# EAGLE design kolektorius_v21 (EAGLE 6.3)
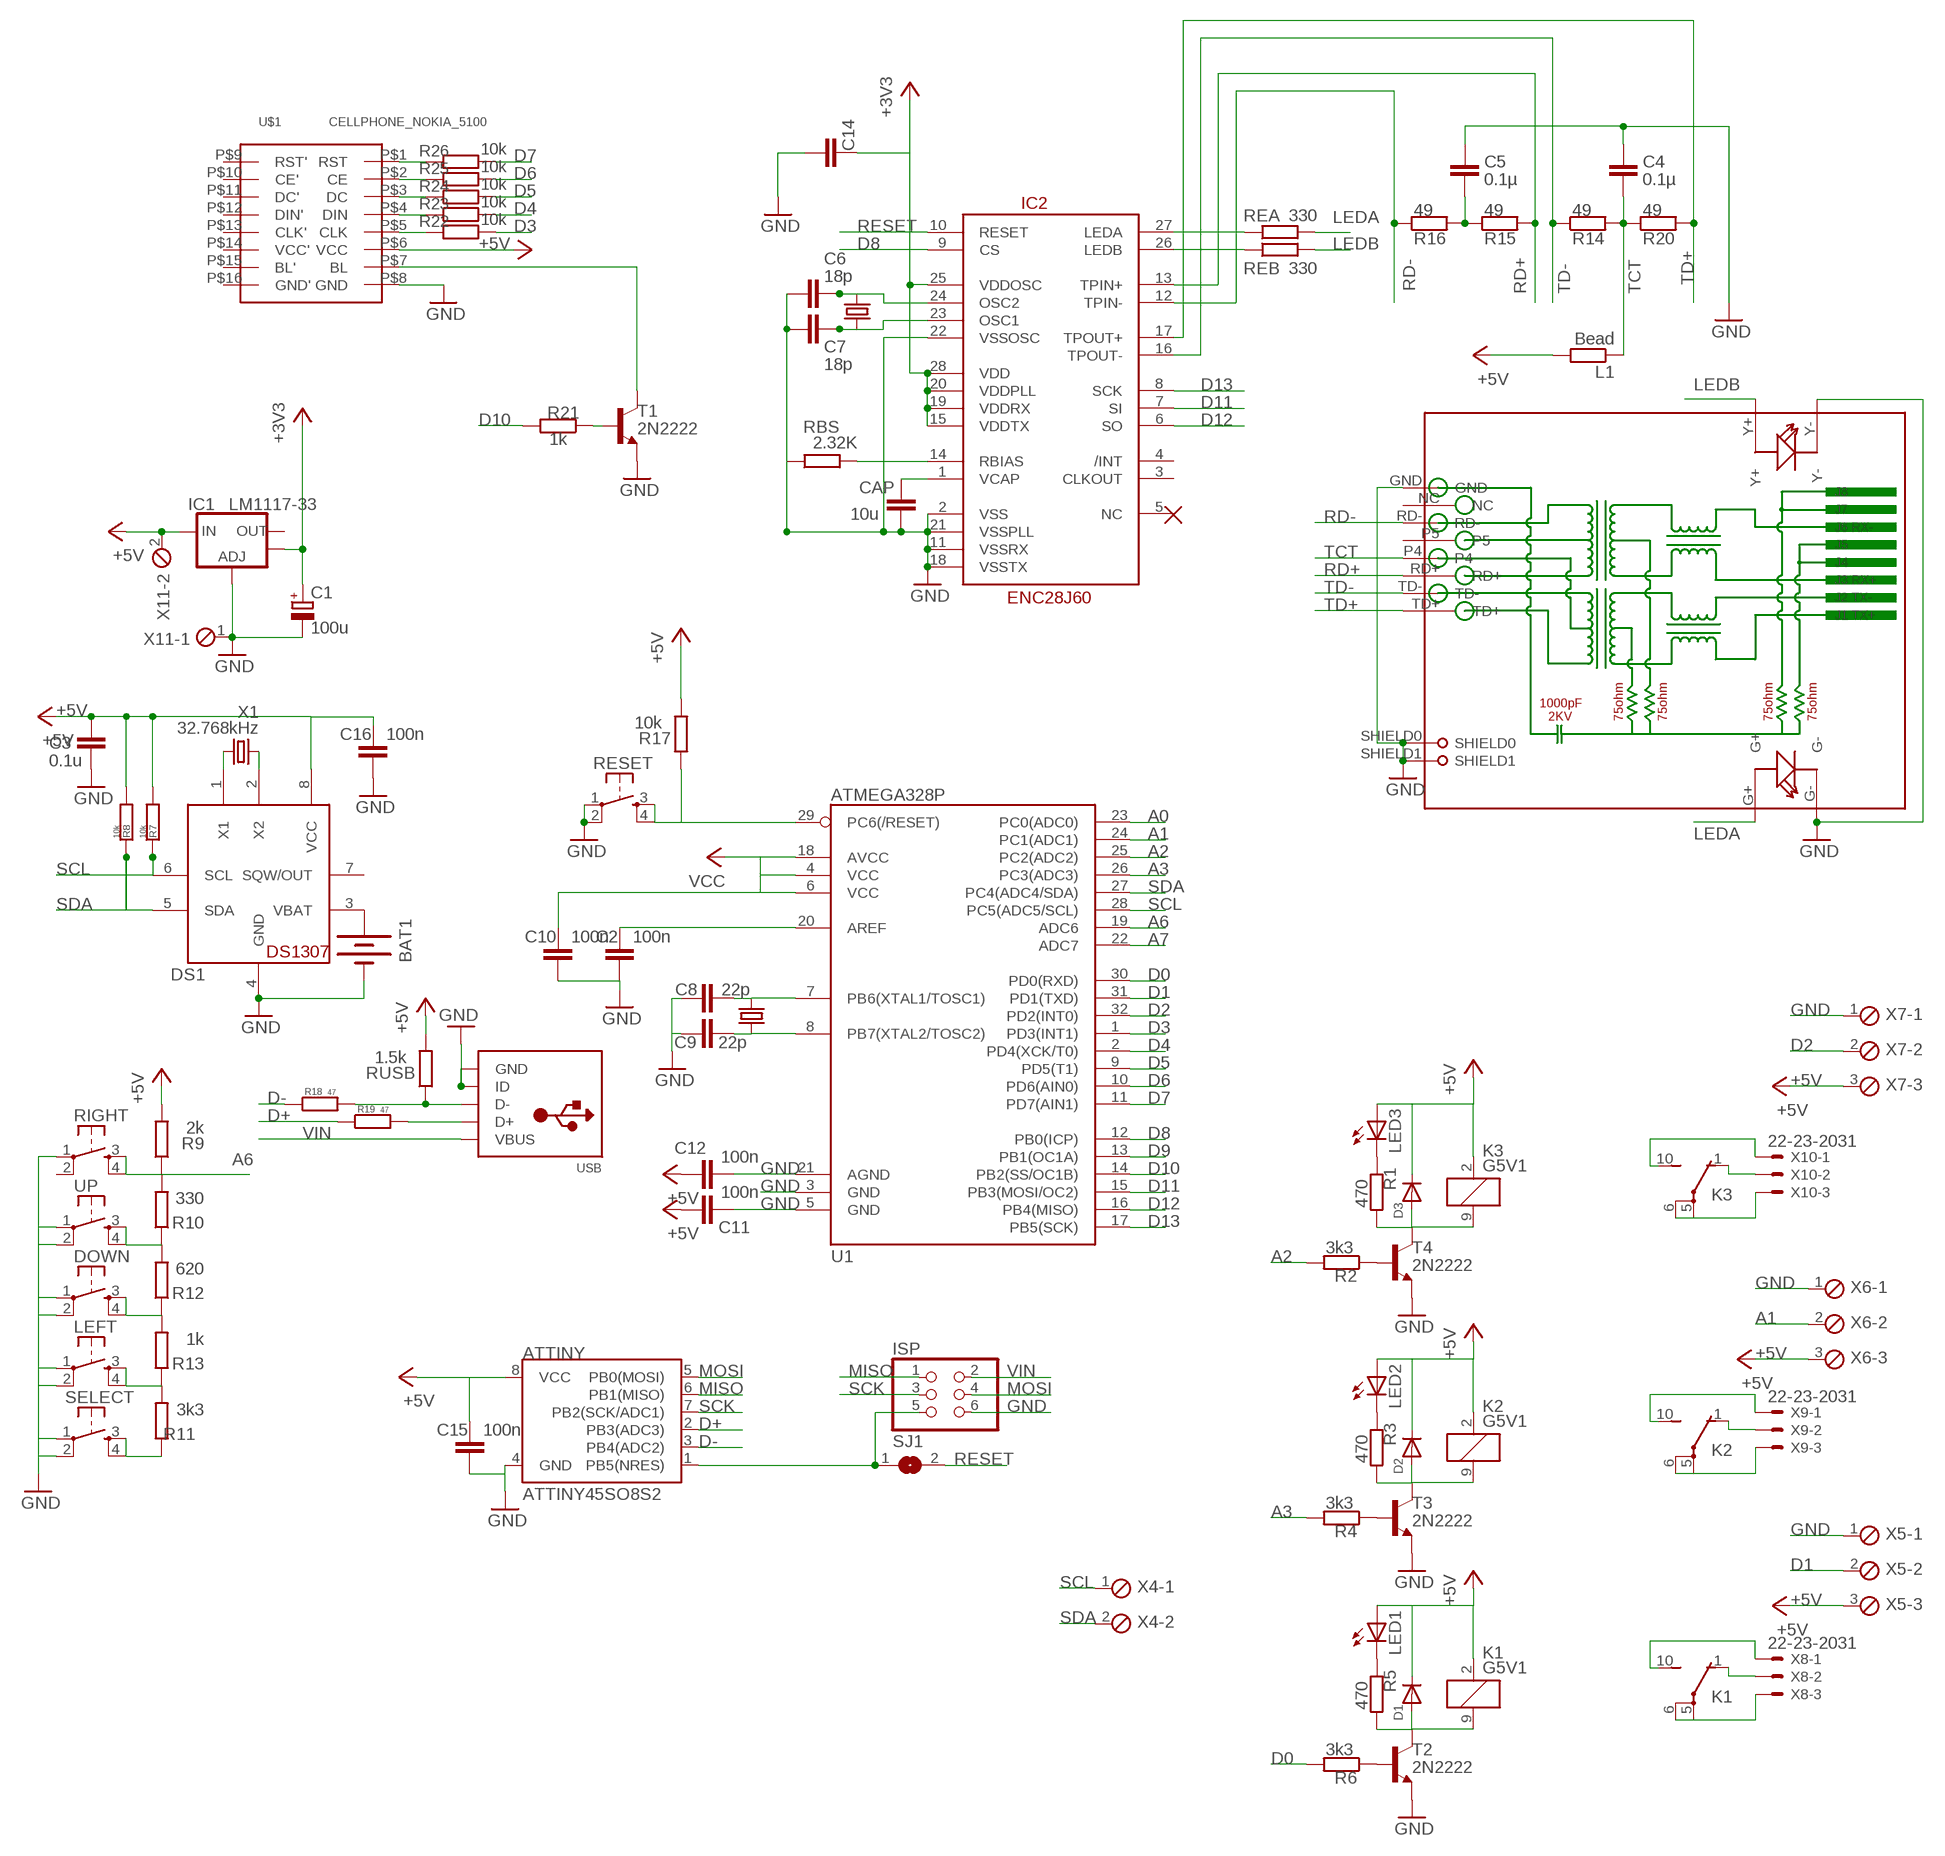
[diagram p0: schematic, sheet 1]

## Parts
ATTINY  ATTINY45SO8S2  [SO8S2]
BAT1  BATTERYBATTERY_12MM_SMT  [BATTCON_12MM_SMT]
C1  100u  CPOL-EUE2-5  [E2-5]
C2  100n  C-EUC0805  [C0805]
C3  0.1u  C-EUC0805  [C0805]
C4  0.1µ  C-EUC0805  [C0805]
C5  0.1µ  C-EUC0805  [C0805]
C6  18p  C-EUC0805  [C0805]
C7  18p  C-EUC0805  [C0805]
C8  22p  C-EUC0805  [C0805]
C9  22p  C-EUC0805  [C0805]
C10  100n  C-EUC0805  [C0805]
C11  100n  C-EUC0805  [C0805]
C12  100n  C-EUC0805  [C0805]
C14  100n  C-EUC0805  [C0805]
C15  100n  C-EUC0805  [C0805]
C16  100n  C-EUC0805  [C0805]
CAP  10u  C-EUC0805  [C0805]
D1  DIODEDO-1N4148  [DO-1N4148]
D2  DIODEDO-1N4148  [DO-1N4148]
D3  DIODEDO-1N4148  [DO-1N4148]
DOWN  TAC_SWITCHPTH  [TACTILE-PTH]
DS1  DS1307  DS1307SOIC  [SO08]
IC1  LM1117-33  V_REG_LM1117SOT223  [SOT223]
IC2  ENC28J60  [SSOP28DB]
ISP  PINHD-2X3  [2X03]
K1  G5V1  [G5V1]
K2  G5V1  [G5V1]
K3  G5V1  [G5V1]
L1  Bead  R-EU_R0805  [R0805]
LED1  LEDSMT1206  [1206]
LED2  LEDSMT1206  [1206]
LED3  LEDSMT1206  [1206]
LEFT  TAC_SWITCHPTH  [TACTILE-PTH]
R1  470  R-EU_R0805  [R0805]
R2  3k3  R-EU_R0805  [R0805]
R3  470  R-EU_R0805  [R0805]
R4  3k3  R-EU_R0805  [R0805]
R5  470  R-EU_R0805  [R0805]
R6  3k3  R-EU_R0805  [R0805]
R7  10k  R-EU_R0805  [R0805]
R8  10k  R-EU_R0805  [R0805]
R9  2k  R-EU_R0805  [R0805]
R10  330  R-EU_R0805  [R0805]
R11  3k3  R-EU_R0805  [R0805]
R12  620  R-EU_R0805  [R0805]
R13  1k  R-EU_R0805  [R0805]
R14  49  R-EU_R0805  [R0805]
R15  49  R-EU_R0805  [R0805]
R16  49  R-EU_R0805  [R0805]
R17  10k  R-EU_R0805  [R0805]
R18  47  R-EU_R0805  [R0805]
R19  47  R-EU_R0805  [R0805]
R20  49  R-EU_R0805  [R0805]
R21  1k  R-EU_R0805  [R0805]
R22  10k  R-EU_R0805  [R0805]
R23  10k  R-EU_R0805  [R0805]
R24  10k  R-EU_R0805  [R0805]
R25  10k  R-EU_R0805  [R0805]
R26  10k  R-EU_R0805  [R0805]
RBS  2.32K  R-EU_R0805  [R0805]
REA  330  R-EU_R0805  [R0805]
REB  330  R-EU_R0805  [R0805]
RESET  TAC_SWITCHPTH  [TACTILE-PTH]
RIGHT  TAC_SWITCHPTH  [TACTILE-PTH]
RJ1  HR911105A  [HR911105A]
RUSB  1.5k  R-EU_R0805  [R0805]
SELECT  TAC_SWITCHPTH  [TACTILE-PTH]
SJ1  SJ  [SJ]
T1  2N2222  [TO92-EBC-OVAL]
T2  2N2222  [TO92-EBC-OVAL]
T3  2N2222  [TO92-EBC-OVAL]
T4  2N2222  [TO92-EBC-OVAL]
U1  ATMEGA328P  ATMEGA328_SMT  [TQFP32-08]
U$1  CELLPHONE_NOKIA_5100  [CELLPHONE_NOKIA_5100_SPARKFUN]
UP  TAC_SWITCHPTH  [TACTILE-PTH]
USB  USBMOLEX  [USB-MINIB-THM-MOLEX]
X1  32.768kHz  CRYSTALTC26H  [TC26H]
X2  16MHz  CRYSTALHC49US  [HC49US]
X3  25MHz  CRYSTALHC49US  [HC49US]
X4  MPT2  [2POL254]
X5  MPT3  [3POL254]
X6  MPT3  [3POL254]
X7  MPT3  [3POL254]
X8  22-23-2031  [22-23-2031]
X9  22-23-2031  [22-23-2031]
X10  22-23-2031  [22-23-2031]
X11  MPT2  [2POL254]

## Nets
+3V3: C1.+ C14.1 IC1.4(OUT) IC2.15(VDDTX) IC2.19(VDDRX) IC2.20(VDDPLL) IC2.25(VDDOSC) IC2.28(VDD)
+5V: ATTINY.8(VCC) C3.1 C11.2 C12.2 C15.1 C16.1 D1.C D2.C D3.C DS1.8(VCC) IC1.3(IN) K1.2 K2.2 K3.2 L1.2 LED1.A LED2.A R7.2 R8.2 U$1.P$6(VCC) X5.3 X6.3 X7.3 X11.2
A0: U1.23(PC0(ADC0))
A1: U1.24(PC1(ADC1)) X6.2
A2: R2.2 U1.25(PC2(ADC2))
A3: R4.2 U1.26(PC3(ADC3))
A6: R9.1 R10.2 RIGHT.3 RIGHT.4 U1.19(ADC6)
A7: U1.22(ADC7)
D0: R6.2 U1.30(PD0(RXD))
D1: U1.31(PD1(TXD)) X5.2
D2: U1.32(PD2(INT0)) X7.2
D3: R22.2 U1.1(PD3(INT1))
D4: R23.2 U1.2(PD4(XCK/T0))
D5: R24.2 U1.9(PD5(T1))
D6: R25.2 U1.10(PD6(AIN0))
D7: R26.2 U1.11(PD7(AIN1))
D8: IC2.9(CS) U1.12(PB0(ICP))
D9: U1.13(PB1(OC1A))
D10: R21.2 U1.14(PB2(SS/OC1B))
D11: IC2.7(SI) U1.15(PB3(MOSI/OC2))
D12: IC2.6(SO) U1.16(PB4(MISO))
D13: IC2.8(SCK) U1.17(PB5(SCK))
D+: ATTINY.2(PB3(ADC3)) R19.1
D-: ATTINY.3(PB4(ADC2)) R18.1
GND: ATTINY.4(GND) BAT1.P$1(-) C1.- C2.2 C3.2 C4.1 C5.1 C6.2 C7.2 C8.1 C9.1 C10.2 C11.1 C12.1 C14.2 C15.2 C16.2 CAP.2 DOWN.1 DOWN.2 DS1.4(GND) IC1.1(ADJ) IC2.2(VSS) IC2.11(VSSRX) IC2.18(VSSTX) IC2.21(VSSPLL) IC2.22(VSSOSC) ISP.6 LEFT.1 LEFT.2 RBS.1 RESET.1 RESET.2 RIGHT.1 RJ1.G- RJ1.GND RJ1.SHIELD0 RJ1.SHIELD1 RJ1.Y- SELECT.1 SELECT.2 T1.E T2.E T3.E T4.E U1.3(GND) U1.5(GND) U1.21(AGND) U$1.P$8(GND) UP.1 UP.2 USB.GND USB.ID X5.1 X6.1 X7.1 X11.1
LEDA: REA.2 RJ1.G+
LEDB: REB.2 RJ1.Y+
MISO: ATTINY.6(PB1(MISO)) ISP.1
MOSI: ATTINY.5(PB0(MOSI)) ISP.4
N$1: LEFT.3 LEFT.4 R11.2 R13.1
N$2: D2.A K2.9 R3.2 T3.C
N$3: R4.1 T3.B
N$4 [power]: K2.5(2:P) K2.6(2:P) X9.3
N$5 [power]: K2.1(2:O) X9.2
N$6: DOWN.3 DOWN.4 R12.1 R13.2
N$7: LED2.C R3.1
N$8: DS1.1(X1) X1.2
N$9: R10.1 R12.2 UP.3 UP.4
N$11: D1.A K1.9 R5.2 T2.C
N$12: D3.A K3.9 R1.2 T4.C
N$13: R2.1 T4.B
N$14 [power]: K2.10(2:S) X9.1
N$15 [power]: K1.10(2:S) X8.1
N$16 [power]: K3.10(2:S) X10.1
N$17: R6.1 T2.B
N$18: R11.1 SELECT.3 SELECT.4
N$19 [power]: K3.5(2:P) K3.6(2:P) X10.3
N$20 [power]: K3.1(2:O) X10.2
N$21: LED3.C R1.1
N$22: R22.1 U$1.P$5(CLK)
N$23: R25.1 U$1.P$2(CE)
N$24: R24.1 U$1.P$3(DC)
N$25: R23.1 U$1.P$4(DIN)
N$26 [signal]: T1.C U$1.P$7(BL)
N$27: LED3.A
N$28 [power]: K1.5(2:P) K1.6(2:P) X8.3
N$29 [power]: K1.1(2:O) X8.2
N$30: DS1.2(X2) X1.1
N$31: LED1.C R5.1
N$32: C9.2 U1.8(PB7(XTAL2/TOSC2)) X2.1
N$33: C8.2 U1.7(PB6(XTAL1/TOSC1)) X2.2
N$34: IC2.27(LEDA) REA.1
N$35: C2.1 U1.20(AREF)
N$36: BAT1.P$2(+) DS1.3(VBAT)
N$37: IC2.26(LEDB) REB.1
N$38: R19.2 USB.D+
N$39: CAP.1 IC2.1(VCAP)
N$41: C6.1 IC2.24(OSC2) X3.2
N$42: C7.1 IC2.23(OSC1) X3.1
N$44: R21.1 T1.B
N$45: R18.2 RUSB.1 USB.D-
N$46: R17.1 RESET.3 RESET.4 U1.29(PC6(/RESET))
N$52: ATTINY.1(PB5(NRES)) ISP.5 SJ1.1
N$54: C5.2 R15.1 R16.2
N$59: IC2.14(RBIAS) RBS.2
RD+: IC2.13(TPIN+) R15.2 RJ1.RD+
RD-: IC2.12(TPIN-) R16.1 RJ1.RD-
RESET: IC2.10(RESET) SJ1.2
SCK: ATTINY.7(PB2(SCK/ADC1)) ISP.3
SCL: DS1.6(SCL) R7.1 U1.28(PC5(ADC5/SCL))
SDA: DS1.5(SDA) R8.1 U1.27(PC4(ADC4/SDA))
TCT: C4.2 L1.1 R14.2 R20.1 RJ1.P4
TD+: IC2.17(TPOUT+) R20.2 RJ1.TD+
TD-: IC2.16(TPOUT-) R14.1 RJ1.TD-
V$: R26.1 U$1.P$1(RST)
VCC: C10.1 R9.2 R17.2 RUSB.2 U1.4(VCC) U1.6(VCC) U1.18(AVCC) ; supply symbol labelled +5V
VIN: ISP.2 USB.VBUS
Unconnected: DS1.7(SQW/OUT) IC1.2(OUT) IC2.3(CLKOUT) IC2.4(/INT) IC2.5(NC) RIGHT.2 RJ1.NC RJ1.P5 U$1.P$9(RST') U$1.P$10(CE') U$1.P$11(DC') U$1.P$12(DIN') U$1.P$13(CLK') U$1.P$14(VCC') U$1.P$15(BL') U$1.P$16(GND') X4.1 X4.2

## Library data of the parts
ATTINY = SparkFun:ATTINY45: Atmel ATTiny45
BAT1 = SparkFunNew:BATTERY: Battery Holders Various common sizes : AA, AAA, 20mm coin cell and 12mm coin cell.
C1 = resistor:CPOL-EU: POLARIZED CAPACITOR, European symbol
C2 C4-C12 C14-C16 CAP = resistor:C-EU: CAPACITOR, European symbol
C3 = rcl:C-EU: CAPACITOR, European symbol
D1-D3 = adafruit:DIODE: Diode SMADIODE - SMA Surface Mount Package 20V 1A Schottky Diode Digikey: 641-1014-6-ND DO-1N4148 - Through Hole Small Current Diode SOD-123 20V 1 A (.5mV Vf) Schottky Diode - Digikey: MBRX120TPMSCT-ND SOD-323 10V 570mA (.38mV Vf, 3ns) Schottky Diode - Digikey: ZLLS410CT-ND SOD-523 30V 30mA Schottky Diode (RB751S-40TE61) - Digikey: RB751S-40TE61CT-ND SOT23-R/W - SOT23 Package (R = Solder Paste/Reflow Ovens, W = Hand-Soldering) BAT54Film 40V 300mA - Digikey: 497-7162-1-ND
DOWN LEFT RESET RIGHT SELECT UP = SparkFun-Electromechanical:TAC_SWITCH: Momentary Switch Button commonly used for reset or general input. Spark Fun Electronics SKU : COM-00097 SMT- SWCH-08247
DS1 = adafruit:DS1307: DS1307 Real time clock (RTC) with battery backup ability. Talk to it via i2c
IC1 = SparkFun:V_REG_LM1117: Voltage Regulator LM1117 Standard adjustable voltage regulator but in SMD form. Spark Fun Electronics SKU : COM-00595
IC2 = SparkFun-DigitalIC:ENC28J60: Microchip SPI 10Base ethernet IC
ISP = pinhead:PINHD-2X3: PIN HEADER
K1-K3 = relay:G5V1: RELAY 1 x switch, 0.5 A/125 V AC, 1 A/24 V DC , Omron; MPN: G5V-1-DC24; OC_FARNELL: 9949593; OC_NEWARK: 36M6377
L1 R1-R26 RBS REA REB RUSB = rcl:R-EU_: RESISTOR, European symbol
LED1-LED3 = adafruit:LED: LED OSRAM: - CHIPLED LG R971, LG N971, LY N971, LG Q971, LY Q971, LO R971, LY R971 LH N974, LH R974 LS Q976, LO Q976, LY Q976 LO Q996 - Hyper CHIPLED LW Q18S LB Q993, LB Q99A, LB R99A - SideLED LS A670, LO A670, LY A670, LG A670, LP A670 LB A673, LV A673, LT A673, LW A673 LH A674 LY A675 LS A676, LA A676, LO A676, LY A676, LW A676 LS A679, LY A679, LG A679 - Hyper Micro SIDELED® LS Y876, LA Y876, LO Y876, LY Y876 LT Y87S - SmartLED LW L88C, LW L88S LB L89C, LB L89S, LG L890 LS L89K, LO L89K, LY L89K LS L896, LA L896, LO L896, LY L896 - TOPLED LS T670, LO T670, LY T670, LG T670, LP T670 LSG T670, LSP T670, LSY T670, LOP T670, LYG T670 LG T671, LOG T671, LSG T671 LB T673, LV T673, LT T673, LW T673 LH T674 LS T676, LA T676, LO T676, LY T676, LB T676, LH T676, LSB T676, LW T676 LB T67C, LV T67C, LT T67C, LS T67K, LO T67K, LY T67K, LW E67C LS E67B, LA E67B, LO E67B, LY E67B, LB E67C, LV E67C, LT E67C LW T67C LS T679, LY T679, LG T679 LS T770, LO T770, LY T770, LG T770, LP T770 LB T773, LV T773, LT T773, LW T773 LH T774 LS E675, LA E675, LY E675, LS T675 LS T776, LA T776, LO T776, LY T776, LB T776 LHGB T686 LT T68C, LB T68C - Hyper Mini TOPLED® LB M676 - Mini TOPLED Santana® LG M470 LS M47K, LO M47K, LY M47K Source: http://www.osram.convergy.de/
RJ1 = CONNECTER:HR911105A
SJ1 = jumper:SJ: SMD solder JUMPER
T1-T4 = adafruit:2N2222: NPN TRANSISTOR Big oval pads
U1 = SparkFun-DigitalIC:ATMEGA328_SMT: 32-Pin Atmega328 part Commonly used on Arduino compatible boards Available in QFP and QFN packages TQFP is IC-09069 QFN is non-stock; PROD_ID: IC-09069
U$1 = DIY-Cellphone:CELLPHONE_NOKIA_5100
USB = adafruit:USB: USB Connectors USBMINIB - Surface Mount Female Mini-B USB Connector 4UConnector: 06564 By microbuilder.eu Thru-hole RA Female Mini-B USB Connector 4UConnector: 18732 By ladyada.net
X1 = crystal:CRYSTAL: CRYSTAL; OC_FARNELL: unknown; OC_NEWARK: unknown
X2 X3 = SparkFun:CRYSTAL: Crystals Various standard crystals. Proven footprints. Spark Fun Electronics SKU : COM-00534
X4 X11 = con-phoenix-254:MPT2: PHOENIX CONNECTOR; OC_FARNELL: unknown; OC_NEWARK: unknown
X5-X7 = con-phoenix-254:MPT3: PHOENIX CONNECTOR; OC_FARNELL: unknown; OC_NEWARK: unknown
X8-X10 = con-molex:22-23-2031: .100" (2.54mm) Center Header - 3 Pin; MF: MOLEX; MPN: 22-23-2031; OC_FARNELL: 1462950; OC_NEWARK: 30C0862

## Net classes
0 default: width 0.406 mm, clearance 0.203 mm
1 power: width 0.61 mm, clearance 0.203 mm
2 GND: width 0.61 mm
3 signal: width 0.457 mm

## Board
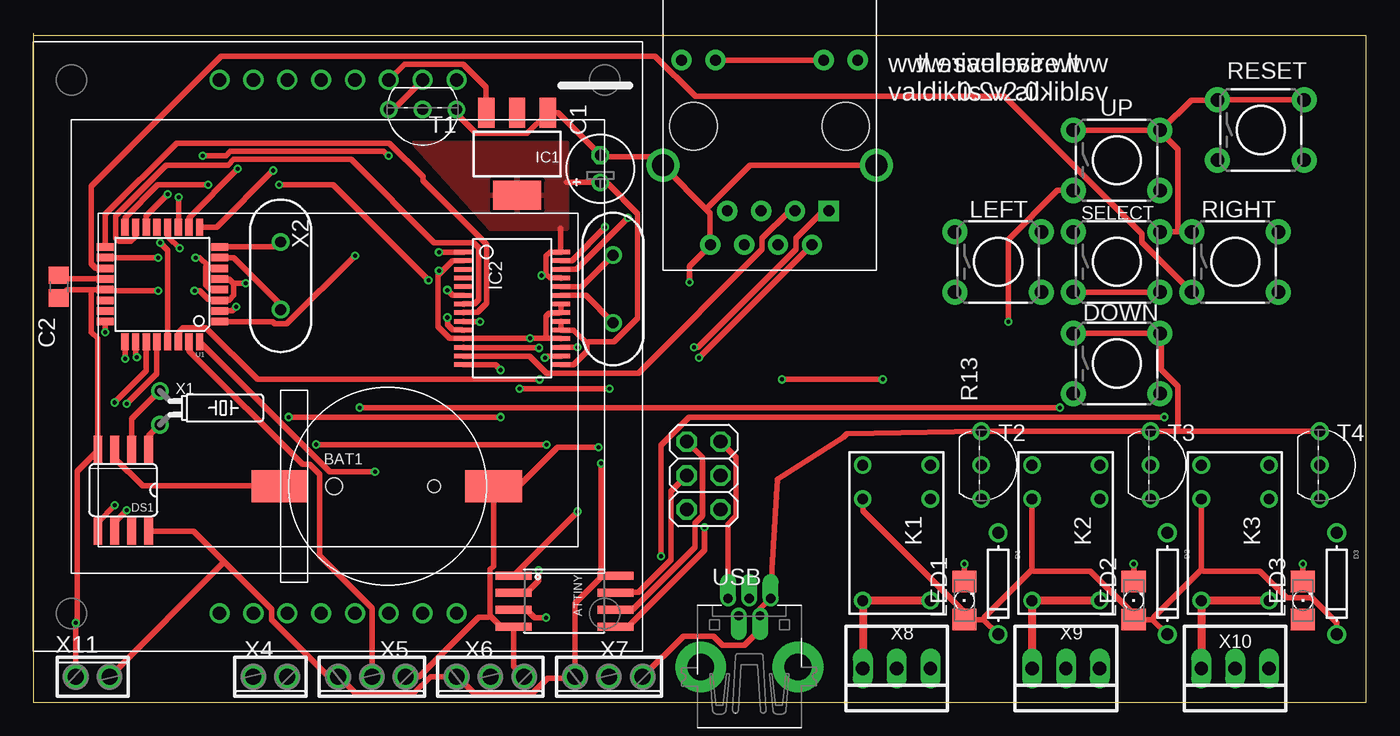
[diagram p1: board, top side]
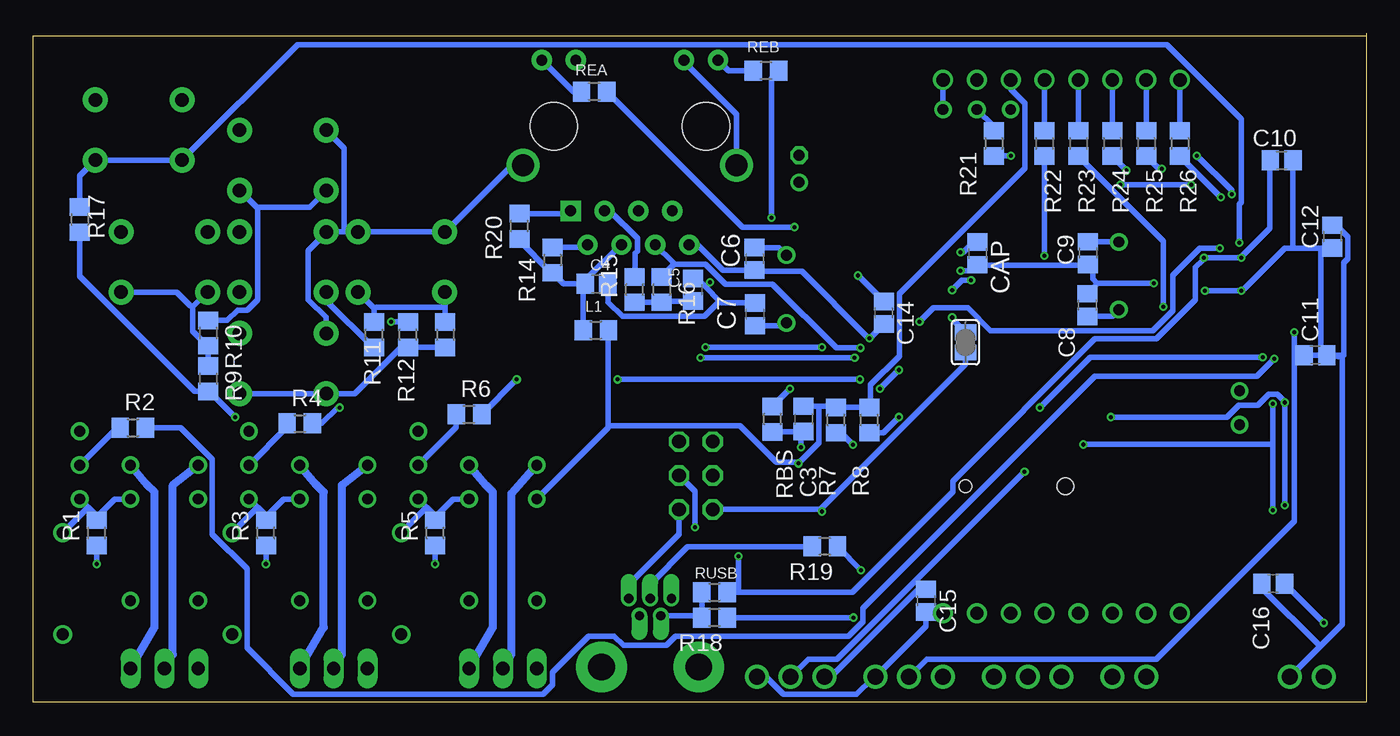
[diagram p2: board, bottom side, seen from below]

Size 100 x 50.16 mm. Coordinates in mm from the lower left corner, seen from the top.
Outline: 0,50 100,50 100,0 0,0 0,50.16
Copper layers (1*16): Top 0.035mm / dielectric 1.5mm / Bottom 0.035mm
Design rules "Fusion_eagle_rule_v1.1": minimum track width 6mil, minimum drill 12mil, track to track 6mil, track to pad 6mil, pad to pad 6mil, via to via 6mil, smd to smd 0mil, copper to edge 10mil, drill to drill 10mil, minimum pad ring 10mil, minimum via ring 6mil, stop-mask expansion 2mil, vias tented up to drill 100mil, thermal gap 10mil
vRestrict: area 32,73 to 71,78

### Footprints (pad centres in the part's own frame; a part is rotated, then mirrored left to right if it is on the bottom)
SO8S2 = smd 0.61 x 2.7: 1 -1.905,-3.778; 2 -0.635,-3.778; 3 0.635,-3.778; 4 1.905,-3.778; 5 1.905,3.853; 6 0.635,3.853; 7 -0.635,3.853; 8 -1.905,3.853
BATTCON_12MM_SMT = smd 2.4 x 4.3: P$1 0,11.96 | smd 2.4 x 4.2: P$2 0,-4.1 | hole 0.95: 0,7.5 | hole 1.25: 0,0
E2-5 = drill 0.813 pad 1.27: + -1.016,0 | drill 0.813 pad 1.27 octagon: - 1.016,0
C0805 = smd 1.3 x 1.5: 1 -0.85,0; 2 0.85,0
C0805' = smd 1.3 x 1.5: 1 -0.95,0; 2 0.95,0
DO-1N4148 = drill 0.9: A -3.81,0; C 3.81,0
TACTILE-PTH = drill 1.016 pad 1.88: 1 -3.251,2.261; 2 3.251,2.261; 3 -3.251,-2.261; 4 3.251,-2.261
SO08 = smd 0.66 x 2.032: 1 -1.905,-3.073; 2 -0.635,-3.073; 3 0.635,-3.073; 4 1.905,-3.073; 5 1.905,3.073; 6 0.635,3.073; 7 -0.635,3.073; 8 -1.905,3.073
SOT223 = smd 1.219 x 2.235: 1 -2.311,-3.099; 2 0,-3.099; 3 2.311,-3.099 | smd 3.6 x 2.2: 4 0,3.099
SSOP28DB = smd 0.348 x 1.397: 1 -4.225,-3.656; 2 -3.575,-3.656; 3 -2.925,-3.656; 4 -2.275,-3.656; 5 -1.625,-3.656; 6 -0.975,-3.656; 7 -0.325,-3.656; 8 0.325,-3.656; 9 0.975,-3.656; 10 1.625,-3.656; 11 2.275,-3.656; 12 2.925,-3.656; 13 3.575,-3.656; 14 4.225,-3.656; 15 4.225,3.656; 16 3.575,3.656; 17 2.925,3.656; 18 2.275,3.656; 19 1.625,3.656; 20 0.975,3.656; 21 0.325,3.656; 22 -0.325,3.656; 23 -0.975,3.656; 24 -1.625,3.656; 25 -2.275,3.656; 26 -2.925,3.656; 27 -3.575,3.656; 28 -4.225,3.656
2X03 = drill 1.016 octagon: 1 -2.54,-1.27; 2 -2.54,1.27; 3 0,-1.27; 4 0,1.27; 5 2.54,-1.27; 6 2.54,1.27
G5V1 = drill 0.813: 1 -5.08,-2.54; 2 -2.54,-2.54; 5 5.08,-2.54; 6 5.08,2.54; 9 -2.54,2.54; 10 -5.08,2.54
R0805 = smd 1.3 x 1.5: 1 -0.95,0; 2 0.95,0
1206 = smd 1.6 x 1.803: A -1.422,0; C 1.422,0
HR911105A = drill 0.813 pad 1.524: G+ 4.953,-6.604; G- 4.953,-4.064; GND -8.89,4.445; NC -6.35,3.175; P4 -8.89,-0.635; P5 -6.35,0.635; RD+ -6.35,-1.905; RD- -8.89,1.905; TD- -8.89,-3.175; Y+ 4.953,6.604; Y- 4.953,4.064 | drill 1.651 pad 2.159: SHIELD0 -2.921,8.001; SHIELD1 -2.921,-8.001 | drill 0.813 pad 1.524 square: TD+ -6.35,-4.445 | hole 3.556: 0,-5.715; 0,5.715
SJ = smd 1.168 x 1.6: 1 -0.762,0; 2 0.762,0
TO92-EBC-OVAL = drill 0.813: B 0,-1.27; C 2.54,-1.27; E -2.54,-1.27
TQFP32-08 = smd 1.27 x 0.559: 1 -4.293,2.8; 2 -4.293,2; 3 -4.293,1.2; 4 -4.293,0.4; 5 -4.293,-0.4; 6 -4.293,-1.2; 7 -4.293,-2; 8 -4.293,-2.8; 17 4.293,-2.8; 18 4.293,-2; 19 4.293,-1.2; 20 4.293,-0.4; 21 4.293,0.4; 22 4.293,1.2; 23 4.293,2; 24 4.293,2.8 | smd 0.559 x 1.27: 9 -2.8,-4.293; 10 -2,-4.293; 11 -1.2,-4.293; 12 -0.4,-4.293; 13 0.4,-4.293; 14 1.2,-4.293; 15 2,-4.293; 16 2.8,-4.293; 25 2.8,4.293; 26 2,4.293; 27 1.2,4.293; 28 0.4,4.293; 29 -0.4,4.293; 30 -1.2,4.293; 31 -2,4.293; 32 -2.8,4.293
CELLPHONE_NOKIA_5100_SPARKFUN = drill 1: P$1 -8.89,20; P$2 -6.35,20; P$3 -3.81,20; P$4 -1.27,20; P$5 1.27,20; P$6 3.81,20; P$7 6.35,20; P$8 8.89,20; P$9 -8.89,-20; P$10 -6.35,-20; P$11 -3.81,-20; P$12 -1.27,-20; P$13 1.27,-20; P$14 3.81,-20; P$15 6.35,-20; P$16 8.89,-20
USB-MINIB-THM-MOLEX = drill 0.7 offset: D+ 0,9.72; D- -0.8,8.42; GND 1.6,9.72; ID 0.8,8.42; VBUS -1.6,9.72 | drill 2 pad 3.81: GND1 -3.65,4.57; GND4 3.65,4.57
TC26H = drill 0.813: 1 -1.27,0; 2 1.27,0
HC49US = drill 0.813: 1 -2.54,0; 2 2.54,0
2POL254 = drill 1.2: 1 -1.27,0; 2 1.27,0
3POL254 = drill 1.2: 1 -2.54,0; 2 0,0; 3 2.54,0
22-23-2031 = drill 1 long: 1 -2.54,0; 2 0,0; 3 2.54,0

### Placement (x,y rotation side)
ATTINY  39.81,7.58 270 top
BAT1  22.57,16.21 270 top
C1  42.55,40.01 90 top
C2  1.91,31.17 270 top
C3  0.1u  [C0805']  42.21,21.24 270 bottom
C4  57.74,31.37 180 bottom
C5  50.49,30.93 270 bottom
C6  45.88,33.26 270 bottom
C7  45.86,29.09 90 bottom
C8  20.92,29.79 270 bottom
C9  20.87,33.69 90 bottom
C10  6.35,40.64 0 bottom
C11  3.81,26.04 0 bottom
C12  2.54,34.92 90 bottom
C14  36.2,29.21 270 bottom
C15  33.02,7.62 270 bottom
C16  6.99,8.89 0 bottom
CAP  29.16,33.66 270 bottom
D1  72.39,8.89 270 top
D2  85.09,8.89 270 top
D3  97.79,8.89 270 top
DOWN  81.28,25.4 0 top
DS1  6.75,15.91 180 top
IC1  36.3,41.12 180 top
IC2  35.93,29.54 270 top
ISP  50.29,17 270 top
K1  64.77,12.7 270 top
K2  77.47,12.7 270 top
K3  90.17,12.7 270 top
L1  57.8,27.91 0 bottom
LED1  69.85,7.62 90 top
LED2  82.55,7.62 90 top
LED3  95.25,7.62 90 top
LEFT  72.39,33.02 0 top
R1  95.25,12.7 90 bottom
R2  92.53,20.6 0 bottom
R3  82.55,12.7 90 bottom
R4  80.01,20.9 0 bottom
R5  69.85,12.7 90 bottom
R6  67.31,21.59 0 bottom
R7  39.78,21.16 90 bottom
R8  37.27,21.16 90 bottom
R9  86.87,24.26 270 bottom
R10  86.87,27.69 270 bottom
R11  74.42,27.56 90 bottom
R12  71.88,27.56 90 bottom
R13  69.09,27.56 270 bottom
R14  61.05,33.16 270 bottom
R15  54.88,30.95 90 bottom
R16  52.87,30.94 270 bottom
R17  96.52,36.2 270 bottom
R18  48.9,6.35 180 bottom
R19  40.62,11.68 180 bottom
R20  63.53,35.7 90 bottom
R21  27.94,41.91 270 bottom
R22  24.13,41.91 270 bottom
R23  21.59,41.91 270 bottom
R24  19.05,41.91 270 bottom
R25  16.51,41.91 270 bottom
R26  13.97,41.91 270 bottom
RBS  44.53,21.23 90 bottom
REA  57.92,45.8 180 bottom
REB  45.03,47.36 180 bottom
RESET  92.09,42.91 0 top
RIGHT  90.17,33.02 0 top
RJ1  55.24,43.2 90 top
RUSB  48.9,8.25 0 bottom
SELECT  81.28,33.02 0 top
SJ1  30.06,26.98 90 bottom
T1  29.21,43.18 180 top
T2  72.39,17.78 270 top
T3  85.09,17.78 270 top
T4  97.79,17.78 270 top
U1  9.68,31.34 180 top
U$1  22.86,26.67 0 top
UP  81.28,40.64 0 top
USB  53.72,-1.93 0 top
X1  9.49,22.08 270 top
X2  18.56,31.98 270 top
X3  43.49,30.99 90 top
X4  17.78,1.91 180 top
X5  25.4,1.91 180 top
X6  34.29,1.91 180 top
X7  43.18,1.91 180 top
X8  64.77,2.54 180 top
X9  77.47,2.54 180 top
X10  90.17,2.54 180 top
X11  4.45,1.91 0 top

### Tracks (layer width: path | path; a pad name or v marks a point on that pad's centre or on a via)
+3V3  (via drill 0.3)
  Top 0.406: 41.53,26.92 41.53,26.31 40.54,25.32 39.6,25.32 IC2.15 | 41.53,26.92 40.54,27.91 IC2.19 | IC2.19 | IC2.20 39.6,28.12 IC2.19 | 38.48,32.11 38.76,31.83 39.57,31.83 IC2.25 | 38.48,32.11 38.48,33.48 38.76,33.76 39.57,33.76 IC2.28 39.57,33.96 39.57,35.56 | 40.01,38.99 C1.+ 42.72,38.89 43.1,38.89 45.34,36.65 45.34,28.78 43.59,27.03 41.71,27.03 41.53,26.92 | v38.12,32 38.3,32 38.48,32.11
  Bottom 0.406: v38.12,32 36.2,30.07 C14.1
  pour Top: 28.57,41.91 40.01,41.91 40.01,35.56 34.29,35.56
+5V  (via drill 0.3)
  Top 0.406: 14.33,10.52 17.88,6.96 17.88,6.17 22.15,1.91 X5.3 23.04,1.8 24.26,0.58 28.47,0.58 29.79,1.91 X6.3 31.93,1.8 33.15,0.58 37.36,0.58 38.58,1.8 40.46,1.8 X7.3 40.64,7.42 42.7,9.47 ATTINY.8 42.6,9.65 v42.6,17.91 | 14.33,10.52 12.01,12.83 DS1.8 | 71.27,6.2 LED1.A | D1.C 71.27,6.2 | LED1.A | 74.93,9.93 K2.2 | 74.93,9.93 71.37,6.38 71.27,6.2 | 83.97,6.2 LED2.A | D2.C 83.97,6.2 | LED2.A | 87.63,9.93 K3.2 | 87.63,9.93 84.07,6.38 83.97,6.2 | D3.C 97.79,5.94 95.91,7.82 94.03,7.82 92.02,9.83 87.81,9.83 87.63,9.93 | 74.93,9.93 75.11,9.83 79.32,9.83 82.78,6.38 LED2.A | IC1.3 33.96,44.22 33.96,46.13 32.23,47.85 27.84,47.85 26.67,46.69 U$1.P$6 | K1.2 62.23,14.38 69.77,6.83 69.77,6.4 LED1.A | 14.33,10.52 X11.2
  Bottom 0.406: 41.05,22.2 39.95,22.2 R7.2 39.78,22.12 37.29,22.12 R8.2 37.19,22.3 37.19,23.8 35.03,25.96 35.03,30.63 25.6,40.06 25.6,44.91 26.67,45.97 U$1.P$6 | 41.05,22.2 42.19,22.2 C3.1 | 41.05,22.2 41.05,19.46 v42.6,17.91 42.77,18.01 44.25,18.01 46.97,20.73 56.87,20.73 | C12.2 2.23,35.76 1.37,34.9 1.37,33.25 1.68,32.94 1.68,26.04 C11.2 1.78,25.86 1.78,5.84 3.44,4.18 | X11.2 3.44,4.18 | 56.87,20.73 56.87,20.6 K1.2 | 56.87,20.73 56.87,27.89 L1.2 | 3.44,4.18 7.82,8.56 C16.1 | X7.3 40.16,1.91 33.6,8.46 33.02,8.46 C15.1
A1  (via drill 0.3)
  Top 0.406: v5.38,27.74 5.38,28.52 U1.24
  Bottom 0.406: v5.38,27.74 5.38,13.59 15.75,3.23 32.97,3.23 X6.2
A2  (via drill 0.3)
  Top 0.406: v6.88,25.76 6.88,27.03 U1.25
  Bottom 0.406: v6.88,25.76 8.2,24.43 20.37,24.43 37.74,7.06 37.74,6.04 38.84,4.95 51.82,4.95 52.5,4.27 55.73,4.27 56.41,4.95 58.34,4.95 61.06,2.23 61.06,1.29 61.75,0.61 80.49,0.61 83.97,4.09 83.97,10.01 86.56,12.6 86.56,18.24 88.92,20.6 R2.2
A3  (via drill 0.3)
  Top 0.406: v7.77,25.88 7.7,25.96 7.7,27.03 U1.26 | v77.01,22.1 v24.49,22.1
  Bottom 0.406: v7.77,25.88 20.7,25.88 v24.49,22.1 | v77.01,22.1 77.17,22.1 78.36,20.9 R4.2
A6
  Top 0.406: RIGHT.3 83.19,34.49 83.19,35.13 72.87,45.44 49.68,45.44 46.66,48.46 14.1,48.46 4.34,38.71 4.34,32.89 4.67,32.56 5.38,32.56 U1.19
  Bottom 0.406: R9.1 R10.2 87.05,26.82 88.04,27.81 88.04,29.64 | RIGHT.3 88.04,29.64 | RIGHT.4 89.23,30.76 88.21,29.74 88.04,29.64
D0  (via drill 0.3)
  Top 0.406: v37.97,24.21 16.82,24.21 12.93,28.09 11.23,28.09 10.9,27.76 10.9,27.05 U1.30 | v63.73,24.21 v56.16,24.21
  Bottom 0.406: v56.16,24.21 v37.97,24.21 | v63.73,24.21 66.34,21.59 R6.2
D1
  Top 0.406: X5.2 25.4,7.06 21.46,11 21.46,17.09 20.73,17.83 20.19,17.83 11.68,26.34 11.68,27.03 U1.31
D2  (via drill 0.3)
  Top 0.406: v25.63,17.3 22.23,17.3 12.5,27.03 U1.32
  Bottom 0.406: v25.63,17.3 39.7,3.23 41.86,3.23 X7.2
D3  (via drill 0.3)
  Top 0.406: v24.13,33.48 19.02,28.37 18.11,28.37 17.96,28.52 13.99,28.52 U1.1
  Bottom 0.406: R22.2 v24.13,33.48
D4  (via drill 0.3)
  Top 0.406: v15.21,29.67 14.91,29.36 13.99,29.36 U1.2
  Bottom 0.406: v15.21,29.67 15.21,34.57 21.59,40.95 R23.2
D5  (via drill 0.3)
  Top 0.406: v17.98,39.88 13.74,35.64 12.5,35.64 U1.9
  Bottom 0.406: v17.98,39.88 19.05,40.95 R24.2
D6  (via drill 0.3)
  Top 0.406: v15.34,40.01 11.68,36.35 U1.10
  Bottom 0.406: v15.34,40.01 15.57,40.01 16.51,40.95 R25.2
D7  (via drill 0.3)
  Top 0.406: v10.9,37.87 10.9,35.64 U1.11
  Bottom 0.406: v10.9,37.87 13.97,40.95 R26.2
D8  (via drill 0.3)
  Top 0.406: v10.97,34.04 10.08,34.92 10.08,35.61 U1.12 | v33.5,28.52 32.41,28.52 32.38,28.55 32.28,28.55 IC2.9
  Bottom 0.406: v10.97,34.04 12.47,34.04 14.5,32 14.5,29.36 16,27.86 28.19,27.86 29.9,29.57 32.46,29.57 v33.5,28.52
D10  (via drill 0.3)
  Top 0.406: v10.08,38.1 8.48,36.5 U1.14 | v12.7,41 14.45,41 14.78,41.33 26.29,41.33 v26.64,40.97
  Bottom 0.406: v10.08,38.1 10.08,38.38 v12.7,41 | v26.64,40.97 R21.2
D11
  Top 0.406: U1.15 7.67,35.61 7.67,34.92 7.32,34.57 6.45,34.57 6.17,34.85 6.17,36.5 9.96,40.28 14.61,40.28 15.04,40.72 23.82,40.72 30.07,34.47 33.02,34.47 33.4,34.09 33.4,30.18 33.1,29.87 32.28,29.87 IC2.7
D12  (via drill 0.3)
  Top 0.406: v13.13,38.81 9.35,38.81 6.88,36.35 U1.16 | v18.44,38.81 22.48,38.81 v29.64,31.65 | v31.06,30.91 31.45,30.53 32.26,30.53 IC2.6
  Bottom 0.406: v18.44,38.81 v13.13,38.81 | v29.64,31.65 30.33,31.65 v31.06,30.91
D13
  Top 0.406: U1.17 5.41,34.16 5.41,36.6 10.74,41.94 26.7,41.94 29.23,39.4 29.23,39.12 34.01,34.34 34.01,29.92 33.33,29.23 32.28,29.23 IC2.8
D+  (via drill 0.3)
  Top 0.406: v37.9,9.91 37.9,9.09 37.03,8.23 36.04,8.23 ATTINY.2
  Bottom 0.406: v37.9,9.91 39.65,11.66 R19.1
D-  (via drill 0.3)
  Top 0.406: v38.46,6.35 37.59,6.35 37.01,6.93 36.04,6.93 ATTINY.3
  Bottom 0.406: v38.46,6.35 R18.1
GND  (via drill 0.3)
  Top 0.406: 4.34,30.94 2.54,30.94 1.93,30.33 C2.2 | 4.34,30.94 U1.21 5.59,30.86 v9.37,30.86 | 4.34,30.94 4.34,27.76 4.83,27.28 4.83,19 DS1.4 4.75,18.8 3.28,17.32 3.28,6.12 v3.17,5.94 X11.1 | IC2.22 39.6,29.84 39.6,29.23 IC2.21 39.4,29.16 38.71,29.16 38.48,28.93 38.48,27.3 | 32.28,27.28 IC2.11 | IC2.18 39.57,27.28 38.48,27.28 38.48,27.3 | 30.57,32.22 30.35,32 30.35,28.17 31.22,27.3 32.08,27.3 IC2.11 | 30.57,32.22 31.45,33.1 32.26,33.1 IC2.2 | 15.04,31.37 15.04,30.5 14.68,30.15 13.99,30.15 U1.3 13.79,30.23 13.13,30.23 12.5,30.86 v12.09,30.86 | 15.04,31.37 14.68,31.73 13.99,31.73 U1.5 | v15.93,31.42 15.21,31.42 15.04,31.37 | X6.1 36.04,2.69 36.04,5.66 ATTINY.4 35.81,5.69 35.05,5.69 34.27,6.48 | 34.27,6.48 34.27,9.96 34.52,10.21 34.52,16.2 BAT1.P$1 34.7,16.33 36.55,16.33 39.34,19.13 v42.39,19.13 | v30.43,32.36 30.57,32.22 | 38.48,27.3 v37.26,27.3 32.49,27.3 IC2.11 | RJ1.Y- 59.28,48.16 RJ1.G- | T1.E 31.75,44.15 33.22,42.67 37.06,42.67 38.46,44.07 IC1.1 38.61,44.2 39.37,44.2 C1.- 42.72,40.92 46.58,40.92 47.22,40.28 RJ1.SHIELD0 47.35,40.11 50.48,36.97 | 50.48,36.97 50.77,36.68 50.77,34.31 RJ1.GND 50.67,34.14 49.23,32.69 v49.23,31.5 | X5.1 28.93,1.91 33.4,6.38 34.09,6.38 34.27,6.48 | X7.1 48.77,4.95 51.03,4.95 51.71,4.27 53.34,4.27 54.43,5.36 54.43,6.3 USB.ID 54.53,6.5 54.53,7.01 55.3,7.77 USB.GND 55.42,7.98 55.42,9.96 55.83,16.71 60.78,19.89 61.04,20.14 T2.E T3.E 85.88,20.32 | DOWN.1 DOWN.2 84.63,27.48 84.63,24.94 85.88,23.7 85.88,20.32 | 85.88,20.32 T4.E | RIGHT.1 85.88,35.28 | 85.88,35.28 SELECT.2 | UP.2 UP.1 | UP.2 84.71,43 86.87,45.16 88.82,45.16 RESET.1 89.03,45.19 95.33,45.19 RESET.2
  Top 0.406: 85.88,35.28 85.88,41.48 84.63,42.72 UP.2 | 50.48,36.97 53.77,40.26 63.22,40.26 RJ1.SHIELD1
  Bottom 0.406: 20.19,31.42 v15.93,31.42 | 20.19,31.42 20.52,31.75 20.52,32.31 20.55,32.33 C9.1 21.06,32.77 28.98,32.77 CAP.2 29.18,32.79 29.62,32.36 v30.43,32.36 | v12.09,30.86 v9.37,30.86 9.2,30.96 6.1,34.06 5.51,34.06 | 31.7,46.62 31.75,46.69 U$1.P$8 T1.E | 49.57,31.15 50.19,31.77 50.47,31.77 C5.1 | 49.57,31.15 48.5,30.09 | 48.5,30.09 48.36,29.95 45.87,29.95 C7.2 | 48.5,30.09 49.66,28.93 55.8,28.93 56.87,30 56.87,31.37 C4.1 | RJ1.GND 50.77,34.29 50.14,34.29 48.26,32.41 45.9,32.41 C6.2 45.7,32.31 42.34,32.31 37.44,27.41 v37.26,27.3 37.24,27.3 36.2,28.35 C14.2 | RJ1.Y- 51.16,48.13 51.16,48.01 47.24,44.09 RJ1.SHIELD0 | v49.23,31.5 49.57,31.15 | v3.17,5.94 6.12,8.89 C16.2 | 5.51,34.06 3.4,34.06 | 3.4,34.06 C12.1 | 3.4,34.06 3.4,26.04 C11.1 | 5.51,34.06 5.51,40.64 C10.2 | C8.1 20.9,30.66 20.3,31.27 20.19,31.42 | ISP.6 51.56,12.6 55.3,8.87 55.3,7.8 USB.GND | RBS.1 44.53,20.3 C3.2 42.39,20.12 v42.39,19.13 | C15.2 33.02,5.71 X6.1 37.01,1.8 38.23,0.58 43.71,0.58 45.03,1.91 X7.1 | 76.68,35.28 LEFT.2 LEFT.1 68.96,35.38 64.08,40.26 63.25,40.26 RJ1.SHIELD1 | 76.68,35.28 SELECT.1 78.13,35.1 79.38,33.86 79.38,30.2 78.03,28.85 DOWN.1 | 76.68,35.28 76.68,41.55 UP.1
LEDA
  Bottom 0.406: REA.2 59.49,45.8 61.82,48.13 RJ1.G+
LEDB
  Bottom 0.406: REB.2 46,47.37 47.85,47.37 48.62,48.13 RJ1.Y+
MISO
  Top 0.406: ATTINY.6 43.69,6.96 44.98,6.96 49.66,11.63 49.66,13.44 50.19,13.97 50.19,18.36 ISP.1
MOSI  (via drill 0.3)
  Top 0.406: v50.37,13.13 50.37,11.4 44.65,5.69 43.69,5.69 ATTINY.5
  Bottom 0.406: v50.37,13.13 50.37,15.82 51.54,16.99 ISP.4
N$1
  Bottom 0.406: 69.09,29.62 69.09,30.71 LEFT.3 | 69.09,29.62 R13.1 | 74.42,29.54 R11.2 | LEFT.4 74.42,29.54 | 69.09,29.62 74.24,29.62 74.42,29.54
N$2
  Bottom 0.406: T3.C 83.19,14.61 | 83.19,14.61 82.55,13.97 R3.2 82.37,14.07 81.2,15.24 K2.9 | 83.19,14.61 D2.A
N$3
  Bottom 0.406: T3.B 80.97,20.62 80.97,20.9 R4.1
N$4
  Top 0.61: K2.6 K2.5 X9.3
N$5
  Bottom 0.61: K2.1 76.83,16.28 76.83,3.58 X9.2
N$6
  Bottom 0.406: R13.2 R12.1 72.06,26.52 72.52,26.52 75.89,23.14 DOWN.3 DOWN.4
N$7  (via drill 0.3)
  Top 0.406: LED2.C v82.55,10.36
  Bottom 0.406: v82.55,10.36 R3.1
N$8
  Top 0.406: DS1.1 8.66,19 8.66,19.99 9.47,20.8 X1.2
N$9  (via drill 0.3)
  Top 0.406: v73.15,28.52 73.15,34.7 76.83,38.38 UP.3
  Bottom 0.406: 83.19,37.03 83.19,30.2 83.97,29.41 84.68,29.41 85.45,28.65 R10.1 | UP.4 83.19,37.03 | v73.15,28.52 71.88,28.52 R12.2 | UP.3 79.27,37.13 83.01,37.13 83.19,37.03
N$11
  Bottom 0.406: T2.C 70.48,14.61 | 70.48,14.61 69.85,13.97 R5.2 69.67,14.07 68.5,15.24 K1.9 | 70.48,14.61 D1.A
N$12
  Bottom 0.406: T4.C 95.89,14.61 | 95.89,14.61 95.25,13.97 R1.2 95.07,14.07 93.9,15.24 K3.9 | 95.89,14.61 D3.A
N$13
  Bottom 0.406: R2.1 93.7,20.6 T4.B
N$14
  Bottom 0.61: K2.10 78.74,16.28 78.21,15.75 78.21,5.61 X9.1
N$15
  Bottom 0.61: K1.10 66.04,16.28 65.51,15.75 65.51,5.61 X8.1
N$16
  Bottom 0.61: K3.10 91.44,16.28 90.91,15.75 90.91,5.61 X10.1
N$17
  Bottom 0.406: T2.B 68.28,20.62 68.28,21.59 R6.1
N$18
  Top 0.406: SELECT.3 SELECT.4
  Bottom 0.406: SELECT.3 78.03,30.12 74.52,26.62 R11.1
N$19
  Top 0.61: K3.6 K3.5 X10.3
N$20
  Bottom 0.61: K3.1 89.53,16.28 89.53,3.58 X10.2
N$21  (via drill 0.3)
  Top 0.406: LED3.C v95.25,10.36
  Bottom 0.406: v95.25,10.36 R1.1
N$22
  Bottom 0.406: U$1.P$5 R22.1
N$23
  Bottom 0.406: U$1.P$2 R25.1
N$24
  Bottom 0.406: U$1.P$3 R24.1
N$25
  Bottom 0.406: U$1.P$4 R23.1
N$26
  Top 0.457: T1.C 27,44.45 U$1.P$7
N$28
  Top 0.61: K1.6 K1.5 X8.3
N$29
  Bottom 0.61: K1.1 64.14,15.65 64.14,3.58 X8.2
N$30
  Top 0.406: DS1.2 7.39,19 7.39,21.26 9.47,23.34 X1.1
N$31  (via drill 0.3)
  Top 0.406: LED1.C v69.85,10.36
  Bottom 0.406: v69.85,10.36 R5.1
N$32
  Top 0.406: U1.8 13.99,34.16 18.19,34.16 18.54,34.52 X2.1
  Bottom 0.406: C9.2 20.85,34.54 18.57,34.54 X2.1
N$33
  Top 0.406: U1.7 13.99,33.33 15.04,33.33 18.54,29.82 18.54,29.46 X2.2
  Bottom 0.406: C8.2 20.9,28.96 19.05,28.96 X2.2
N$34  (via drill 0.3)
  Top 0.406: v42.9,35.64 42.9,35.61 40.41,33.12 IC2.27
  Bottom 0.406: v42.9,35.64 46.81,35.64 56.95,45.77 REA.1
N$35
  Top 0.406: U1.20 2.18,31.75 1.93,32 C2.1
N$36
  Top 0.406: DS1.3 6.12,18.97 6.12,18.31 8.2,16.23 18.47,16.23 BAT1.P$2
N$37  (via drill 0.3)
  Top 0.406: v44.63,36.35 40.77,32.49 39.6,32.49 IC2.26
  Bottom 0.406: v44.63,36.35 44.63,46.81 REB.1
N$38
  Bottom 0.406: R19.2 41.58,11.66 50.9,11.66 53.7,8.87 53.7,7.8 USB.D+
N$39  (via drill 0.3)
  Top 0.406: v30.43,33.76 32.26,33.76 IC2.1
  Bottom 0.406: v30.43,33.76 30.2,33.76 29.46,34.49 29.18,34.49 CAP.1
N$41
  Top 0.406: IC2.24 41.12,31.17 X3.2
  Bottom 0.406: C6.1 45.87,34.09 44.04,34.09 43.51,33.55 X3.2
N$42
  Top 0.406: IC2.23 39.6,30.5 41.45,30.5 43.48,28.47 X3.1
  Bottom 0.406: C7.1 45.85,28.25 43.71,28.25 43.51,28.45 X3.1
N$44
  Bottom 0.406: R21.1 27.94,43.18 T1.B
N$45
  Bottom 0.406: RUSB.1 49.84,8.23 49.84,6.35 R18.2 50.01,6.5 52.91,6.5 USB.D-
N$46  (via drill 0.3)
  Top 0.406: v9.53,34.47 10.08,33.91 U1.29
  Bottom 0.406: R17.1 96.52,39.47 95.35,40.64 RESET.4 95.15,40.64 89.03,40.64 RESET.3 88.82,40.66 80.16,49.33 14.96,49.33 9.37,43.74 9.37,37.49 9.53,37.34 v9.53,34.47
N$52  (via drill 0.3)
  Top 0.406: v40.84,14.3 36.04,9.5 ATTINY.1
  Bottom 0.406: 40.95,14.48 30.07,25.35 30.07,26.21 SJ1.1 | 40.95,14.48 49,14.48 ISP.5 | v40.84,14.3 40.95,14.48
N$54
  Bottom 0.406: C5.2 52.78,30.07 52.86,30 R16.2 53.06,30 54.86,30 R15.1
N$59  (via drill 0.3)
  Top 0.406: v35.05,24.92 34.67,25.3 32.28,25.3 IC2.14 | v43.23,23.5 v36.47,23.5
  Bottom 0.406: v36.47,23.5 v35.05,24.92 | v43.23,23.5 44.53,22.2 RBS.2
RD+
  Top 0.406: IC2.13 32.28,25.96 37.24,25.96 38.51,24.69 45.39,24.69 54.69,33.98 54.69,34.8 56.72,36.83 57.12,36.83 RJ1.RD+
  Bottom 0.406: R15.2 54.86,31.9 54.86,33.66 54.69,33.83 54.69,34.8 56.72,36.83 57.12,36.83 RJ1.RD+
RD-  (via drill 0.3)
  Top 0.406: v37.95,26.57 37.92,26.59 32.28,26.59 IC2.12
  Bottom 0.406: v37.95,26.57 39.75,26.57 44.53,31.34 48.06,31.34 49.55,32.84 51.92,32.84 | 51.92,32.84 52.86,31.9 R16.1 | RJ1.RD- 53.31,34.29 52.02,32.99 51.92,32.84
RESET  (via drill 0.3)
  Top 0.406: v31.06,28.85 31.06,28.32 31.45,27.94 32.13,27.94 32.16,27.91 32.26,27.91 IC2.10
  Bottom 0.406: v31.06,28.85 31.06,28.75 30.07,27.76 SJ1.2
SCK
  Top 0.406: ATTINY.7 43.69,8.23 45.39,8.23 47.83,10.67 47.83,15.82 49,16.99 ISP.3
SCL  (via drill 0.3)
  Top 0.406: v7.01,22.38 9.27,24.64 9.27,27.03 U1.28 | v7.01,14.4 6.12,13.51 6.12,12.85 DS1.6 | v38.51,19.3 21.23,19.3 v21.21,19.33
  Bottom 0.406: v7.01,14.4 7.01,19.33 | 7.01,19.33 v7.01,22.38 | v38.51,19.3 39.4,20.19 39.78,20.19 R7.1 | 7.01,19.33 v21.21,19.33
SDA  (via drill 0.3)
  Top 0.406: v6.1,22.48 8.48,24.87 8.48,27.03 U1.27 | v6.1,14.76 4.85,13.51 4.85,12.85 DS1.5 | v19.15,21.39 v35.05,21.39
  Bottom 0.406: v6.1,14.76 v6.1,22.48 6.22,22.63 6.68,23.09 7.32,23.09 8.13,22.28 9.55,22.28 10.44,21.39 v19.15,21.39 | v35.05,21.39 36.22,20.22 R8.1
TCT
  Bottom 0.406: C4.2 58.6,31.39 60.22,31.39 61.04,32.21 R14.2 61.21,32.28 63.52,34.59 R20.1 | L1.1 58.75,31.22 C4.2 | RJ1.P4 55.88,34.29 55.96,34.29 58.67,31.57 C4.2
TD+  (via drill 0.3)
  Top 0.406: v40.82,26.62 IC2.17 | v49.55,26.62 49.86,26.62 57.23,33.98 57.23,34.8 59.26,36.83 59.66,36.83 RJ1.TD+
  Bottom 0.406: v49.55,26.62 v40.82,26.62 | R20.2 59.87,36.65 59.69,36.83 RJ1.TD+
TD-  (via drill 0.3)
  Top 0.406: v38.38,25.83 38.51,25.96 39.57,25.96 IC2.16 | v49.94,25.83 58.4,34.29 RJ1.TD-
  Bottom 0.406: v49.94,25.83 v38.38,25.83 | R14.1 61.04,34.11 58.6,34.11 58.42,34.29 RJ1.TD-
V$
  Bottom 0.406: U$1.P$1 R26.1
VCC  (via drill 0.3)
  Top 0.406: v9.37,33.33 5.41,33.33 U1.18 | v12.17,33.33 12.5,33.33 13.07,32.75 | 13.07,32.75 13.26,32.56 13.97,32.56 U1.6 | U1.4 13.97,30.96 13.26,30.96 12.93,31.29 12.93,32.61 13.07,32.75 | v84.86,21.39 49.2,21.39 47.09,19.28 v47.09,10.95
  Bottom 0.406: R17.2 96.52,31.95 87.88,23.32 R9.2 86.69,23.22 v84.86,21.39 | 47.09,8.26 38.53,8.26 31.01,15.77 31.01,16.59 20.34,27.25 15.75,27.25 12.8,30.2 12.8,32.61 12.27,33.15 v12.17,33.33 v9.37,33.33 9.27,33.5 7.21,35.56 7.21,40.64 C10.1 | 47.09,8.26 47.93,8.26 RUSB.2 | 47.09,8.26 v47.09,10.95
VIN
  Top 0.406: USB.VBUS 52.12,13.36 52.73,13.97 52.73,18.36 ISP.2

### Text on the board
tNames: www.saulevire.lt / valdiklis v2.0 | www.saulevire.lt / valdiklis v2.0
BoxDim: Serpac WM-032C Enclosure | All units are in inch | Left | Right | Front | Bottom